# EAGLE design esp (EAGLE 9.0.1)
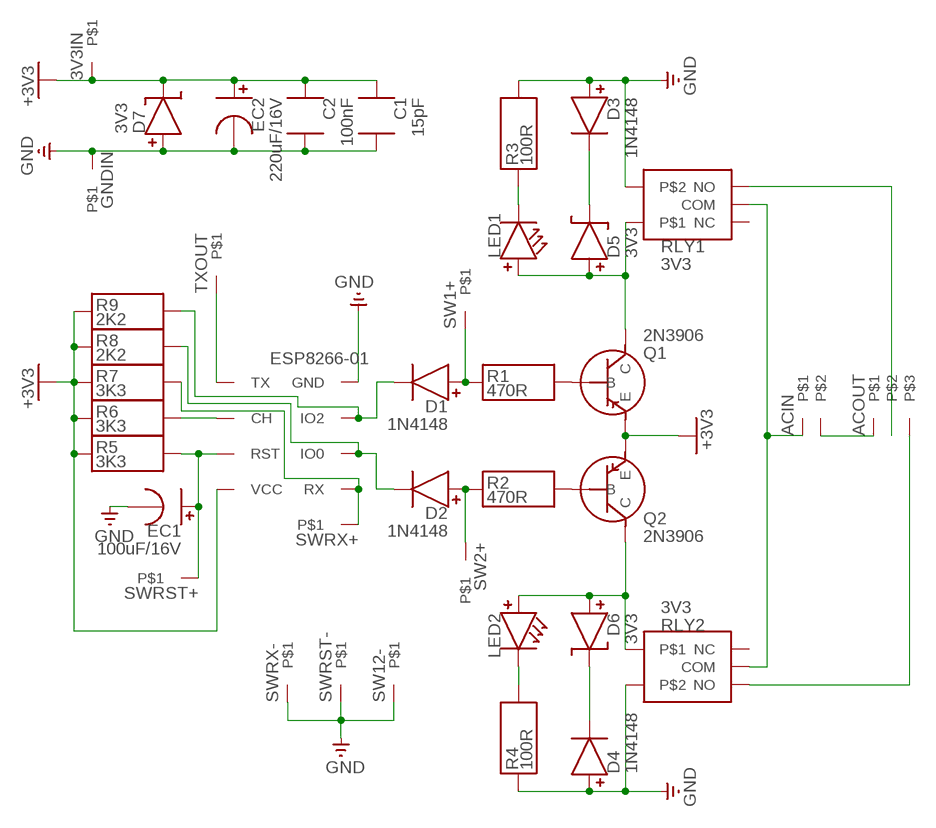
[diagram p0: schematic, sheet 1]

## Parts
3V3IN  CON1PINPLUG1  [PINPLUG1]
ACIN  CON2CON5.0S2T  [CON5.0S2T]
ACOUT  CON3CON5.0S3T  [CON5.0S3T]
C1  15pF  CAPACITORCERCAP3.2S  [CERCAP3.2S]
C2  100nF  CAPACITORCERCAP5.6S  [CERCAP5.6S]
D1  1N4148  RECTDIODERD5.0S1.8D  [RD5.0S1.8D]
D2  1N4148  RECTDIODERD5.0S1.8D  [RD5.0S1.8D]
D3  1N4148  RECTDIODERD5.0S1.8D  [RD5.0S1.8D]
D4  1N4148  RECTDIODERD5.0S1.8D  [RD5.0S1.8D]
D5  3V3  ZENDIODEZD6.0S2.0D  [ZD6.0S2.0D]
D6  3V3  ZENDIODEZD6.0S2.0D  [ZD6.0S2.0D]
D7  3V3  ZENDIODEZD6.0S2.0D  [ZD6.0S2.0D]
EC1  100uF/16V  ECAPACITORECAP3.2S5.0D  [ECAP3.2S5.0D]
EC2  220uF/16V  ECAPACITORECAP3.2S5.0D  [ECAP3.2S5.0D]
ESP8266-01  ESP8266E01ESP8266E01  [ESP8266E01]
GNDIN  CON1PINPLUG1  [PINPLUG1]
LED1  LEDLED3.2S5.0D  [LED3.2S5.0D]
LED2  LEDLED3.2S5.0D  [LED3.2S5.0D]
Q1  2N3906  BJTPNPTO92  [TO92]
Q2  2N3906  BJTPNPTO92  [TO92]
R1  470R  RESISTORHOR.25W  [HOR.25W]
R2  470R  RESISTORHOR.25W  [HOR.25W]
R3  100R  RESISTORHOR.25W  [HOR.25W]
R4  100R  RESISTORHOR.25W  [HOR.25W]
R5  3K3  RESISTORHOR.25W  [HOR.25W]
R6  3K3  RESISTORHOR.25W  [HOR.25W]
R7  3K3  RESISTORHOR.25W  [HOR.25W]
R8  2K2  RESISTORHOR.25W  [HOR.25W]
R9  2K2  RESISTORHOR.25W  [HOR.25W]
RLY1  3V3  RELAY5RLY15W19L  [RLY15W19L]
RLY2  3V3  RELAY5RLY15W19L  [RLY15W19L]
SW1+  CON1PINPLUG1  [PINPLUG1]
SW2+  CON1PINPLUG1  [PINPLUG1]
SW12-  CON1PINPLUG1  [PINPLUG1]
SWRST+  CON1PINPLUG1  [PINPLUG1]
SWRST-  CON1PINPLUG1  [PINPLUG1]
SWRX+  CON1PINPLUG1  [PINPLUG1]
SWRX-  CON1PINPLUG1  [PINPLUG1]
TXOUT  CON1PINPLUG1  [PINPLUG1]

## Nets
+3V3: 3V3IN.P$1 C1.P$1 C2.P$1 D7.P- EC2.P+ ESP8266-01.VCC Q1.3(E) Q2.3(E) R5.P$1 R6.P$1 R7.P$1 R8.P$1 R9.P$1
GND: C1.P$2 C2.P$2 D3.P+ D4.P+ D7.P+ EC1.P- EC2.P- ESP8266-01.GND GNDIN.P$1 R3.P$2 R4.P$1 RLY1.P$2 RLY2.P$2 SW12-.P$1 SWRST-.P$1 SWRX-.P$1
N$1: LED2.P- R4.P$2
N$2: ESP8266-01.CH R6.P$2
N$3: ESP8266-01.RX R7.P$2 SWRX+.P$1
N$4: Q1.2(B) R1.P$2
N$5: D1.P+ R1.P$1 SW1+.P$1
N$6: D2.P- ESP8266-01.IO0 R8.P$2
N$7: D6.P+ LED2.P+ Q2.1(C) RLY2.P$1
N$8: LED1.P- R3.P$1
N$9: D4.P- D6.P-
N$10: EC1.P+ ESP8266-01.RST R5.P$2 SWRST+.P$1
N$11 [ac]: ACOUT.P$3 RLY2.NO
N$12: D5.P+ LED1.P+ Q1.1(C) RLY1.P$1
N$13: ESP8266-01.TX TXOUT.P$1
N$14: D3.P- D5.P-
N$15 [ac]: ACOUT.P$2 RLY1.NO
N$16 [ac]: ACIN.P$2 ACOUT.P$1
N$17: Q2.2(B) R2.P$2
N$18: D2.P+ R2.P$1 SW2+.P$1
N$20 [ac]: ACIN.P$1 RLY1.COM RLY2.COM
N$23: D1.P- ESP8266-01.IO2 R9.P$2
Unconnected: RLY1.NC RLY2.NC

## Library data of the parts
3V3IN GNDIN SW1+ SW2+ SW12- SWRST+ SWRST- SWRX+ SWRX- TXOUT = simple-parts:CON1
ACIN = simple-parts:CON2
ACOUT = simple-parts:CON3
C1 C2 = simple-parts:CAPACITOR
D1-D4 = simple-parts:RECTDIODE
D5-D7 = simple-parts:ZENDIODE
EC1 EC2 = simple-parts:ECAPACITOR
ESP8266-01 = simple-parts:ESP8266E01
LED1 LED2 = simple-parts:LED
Q1 Q2 = simple-parts:BJTPNP
R1-R9 = simple-parts:RESISTOR
RLY1 RLY2 = simple-parts:RELAY5

## Net classes
0 default: width 0.45 mm, clearance 0.45 mm
1 ac: width 1 mm, clearance 1 mm

## Board
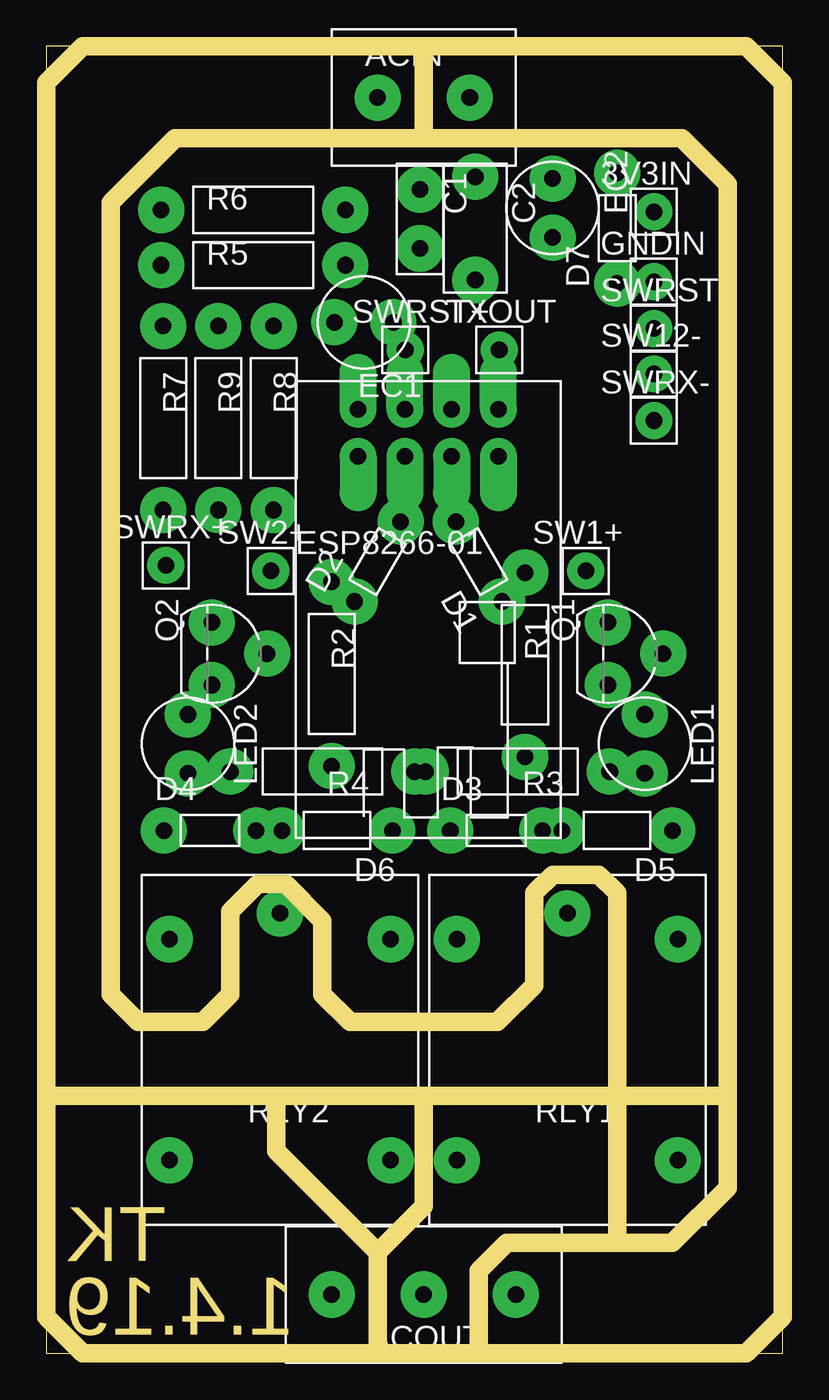
[diagram p1: board, top side]
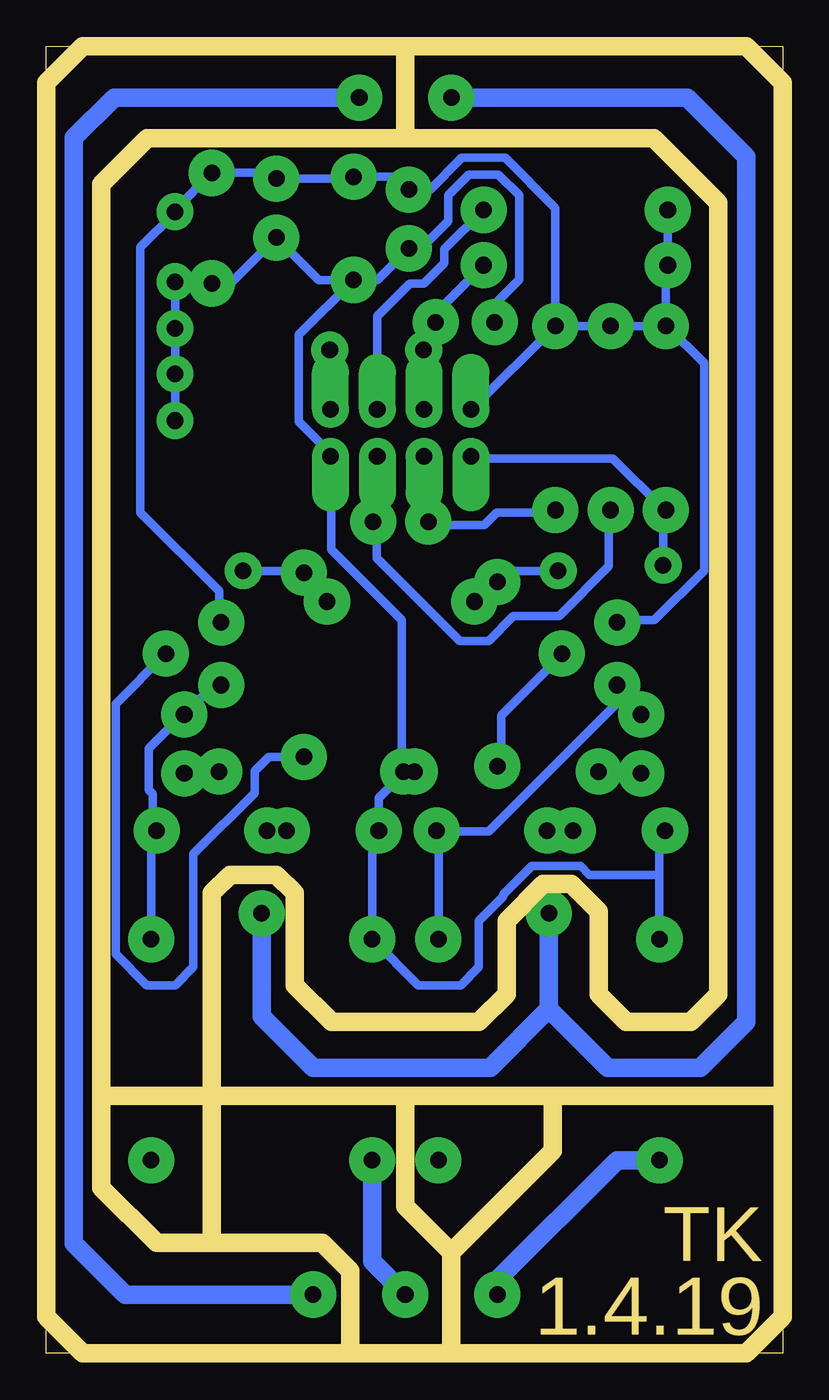
[diagram p2: board, bottom side, seen from below]

Size 40 x 71 mm. Coordinates in mm from the lower left corner, seen from the top.
Outline: 0,0 40,0 40,71 0,71 0,0
Copper layers (1*16): Top 0.035mm / dielectric 1.5mm / Bottom 0.035mm
Design rules "default": minimum track width 6mil, minimum drill 0.35mm, track to track 6mil, track to pad 6mil, pad to pad 6mil, via to via 6mil, smd to smd 6mil, copper to edge 40mil, drill to drill 6mil, minimum pad ring 10mil, minimum via ring 8mil, stop-mask expansion 4mil, vias tented up to drill 0mil, thermal gap 10mil
Milling: 51 lines

### Footprints (pad centres in the part's own frame; a part is rotated, then mirrored left to right if it is on the bottom)
PINPLUG1 = drill 0.9 pad 2: P$1 0,0
CON5.0S2T = drill 0.9 pad 2.5: P$1 -2.5,0; P$2 2.5,0
CON5.0S3T = drill 0.9 pad 2.5: P$1 -5,0; P$2 0,0; P$3 5,0
CERCAP3.2S = drill 0.9 pad 2.5: P$1 -1.6,0; P$2 1.6,0
CERCAP5.6S = drill 0.9 pad 2.5: P$1 -2.8,0; P$2 2.8,0
RD5.0S1.8D = drill 0.9 pad 2.5: P+ -2.5,0; P- 2.5,0
ZD6.0S2.0D = drill 0.9 pad 2.5: P+ -3,0; P- 3,0
ECAP3.2S5.0D = drill 0.9 pad 2.5: P+ -1.6,0; P- 1.6,0
ESP8266E01 = drill 0.9 pad 2 offset: CH -1.27,-1.27; GND -3.81,1.27; IO0 1.27,1.27; IO2 -1.27,1.27; RST 1.27,-1.27; RX 3.81,1.27; TX -3.81,-1.27; VCC 3.81,-1.27
LED3.2S5.0D = drill 0.9 pad 2.5: P+ -1.6,0; P- 1.6,0
TO92 = drill 0.9 pad 2.5: 1 1.7,0; 2 0,3; 3 -1.7,0
HOR.25W = drill 0.9 pad 2.5: P$1 -5,0; P$2 5,0
RLY15W19L = drill 0.9 pad 2.5: COM 0,-7.4; NC -6,6; NO 6,6; P$1 -6,-6; P$2 6,-6

### Placement (x,y rotation side)
3V3IN  33,62 0 top
ACIN  20.5,68.2 0 top
ACOUT  20.5,3.2 180 top
C1  20.3,61.61 270 top
C2  23.3,61.1 270 top
D1  23.5,43 120 top
D2  18,43 60 top
D3  24.44,28.4 0 top
D4  8.9,28.4 0 top
D5  31,28.4 180 top
D6  15.8,28.4 180 top
D7  31,61.11 90 top
EC1  17.25,56 180 top
EC2  27.5,62.2 270 top
ESP8266-01  20.75,50 180 top
GNDIN  33,58.2 0 top
LED1  32.5,33.1 270 top
LED2  7.7,33.1 270 top
Q1  30.5,38 270 top
Q2  9,38 270 top
R1  26,37.4 270 top
R2  15.5,36.9 270 top
R3  25.6,31.6 180 top
R4  15,31.6 180 top
R5  11.25,59.1 0 top
R6  11.25,62.1 0 top
R7  6.35,50.8 270 top
R8  12.35,50.8 270 top
R9  9.35,50.8 270 top
RLY1  28.3,16.5 180 top
RLY2  12.7,16.5 180 top
SW1+  29.3,42.5 0 top
SW2+  12.2,42.5 0 top
SW12-  33,53.2 0 top
SWRST+  19.5,54.5 0 top
SWRST-  33,55.66 0 top
SWRX+  6.5,42.8 0 top
SWRX-  33,50.66 0 top
TXOUT  24.6,54.5 0 top

### Tracks (layer width: path | path; a pad name or v marks a point on that pad's centre or on a via)
+3V3
  Bottom 0.45: R6.P$1 R5.P$1 6.35,59 R7.P$1 | R7.P$1 R9.P$1 R8.P$1 | R8.P$1 16.88,51.27 ESP8266-01.VCC | Q2.3 9,39.83 6.97,39.83 4.28,42.52 4.28,53.77 6.3,55.8 R7.P$1 | Q1.3 30.6,39.83 30.6,41.4 34.88,45.67 34.88,60.08 33.08,61.88 3V3IN.P$1 33,62.11 D7.P- 27.81,64.11 EC2.P+ 23.4,63.8 C2.P$1 20.99,63.9 C1.P$1 19.14,63.21 17.42,64.92 15.08,64.92 12.35,62.2 R8.P$1
GND
  Bottom 0.45: RLY2.P$2 6.7,26 | 6.7,26 6.7,28.1 D4.P+ | 6.7,26 10.5,26 10.97,26.48 13.62,26.48 15.18,24.93 15.18,24.82 16.5,23.5 16.5,21 17.5,20 19.8,20 RLY1.P$2 22.3,28.04 D3.P+ 21.94,30.16 20.5,31.6 | C2.P$2 25.2,58.3 EC2.P- 29.99,58.11 D7.P+ 31.09,58.2 GNDIN.P$1 SWRST-.P$1 SW12-.P$1 SWRX-.P$1 32.85,50.62 | C2.P$2 22.01,58.3 C1.P$2 19.66,60.01 18.18,61.49 18.18,62.9 17.05,64.03 15.45,64.03 14.32,62.9 14.32,58.3 15.65,56.98 EC1.P- | 20.5,31.6 R3.P$2 20.7,31.73 20.7,39.83 24.52,43.65 24.52,48.6 ESP8266-01.GND | 20.5,31.6 R4.P$1 | 24.75,48.83 ESP8266-01.GND | ESP8266-01.GND 24.56,48.9 26.27,50.62 26.27,55.33 C2.P$2
N$1
  Bottom 0.45: LED2.P- 7.8,31.6 R4.P$2
N$2
  Bottom 0.45: ESP8266-01.CH 22.02,56.33 20.27,58.09 19.5,58.09 18.38,59.21 18.38,59.98 R6.P$2
N$3
  Bottom 0.45: SWRX+.P$1 6.5,45.65 R7.P$2 6.53,45.9 9.22,48.6 16.88,48.6 ESP8266-01.RX
N$4
  Bottom 0.45: R1.P$2 27.9,32.4 28.68,31.62 28.68,30.45 32,27.12 32,21 33,20 34.52,20 36.23,21.7 36.23,35.27 Q1.2
N$5
  Bottom 0.45: SW1+.P$1 26.1,42.5 R1.P$1 24.75,41.15 D1.P+
N$6
  Bottom 0.45: ESP8266-01.IO0 19.48,45.4 D2.P- 19.12,45 16.2,45 15.53,45.67 12.38,45.67 R8.P$2
N$7
  Bottom 0.45: LED2.P+ 9,36 Q2.1 8.78,35.55 15.97,28.35 18.45,28.35 D6.P+ 18.68,28.35 18.68,22.5 RLY2.P$1
N$8
  Bottom 0.45: LED1.P- 32.4,31.6 R3.P$1
N$9
  Bottom 0.45: D4.P- D6.P-
N$10
  Bottom 0.45: ESP8266-01.RST 19.48,54.48 SWRST+.P$1 19.5,55.35 EC1.P+ 18.85,56.5 R5.P$2
N$11
  Bottom 1: RLY2.NO 9,10.5 15.5,4 ACOUT.P$3
N$12
  Bottom 0.45: Q1.1 30.9,36.3 LED1.P+ 32.62,34.65 34.42,32.85 34.42,30.6 34.2,30.38 34.2,28.57 D5.P+ 34.3,28.1 RLY1.P$1
N$13
  Bottom 0.45: ESP8266-01.TX 24.56,54.46 TXOUT.P$1
N$14
  Bottom 0.45: D5.P- D3.P-
N$15
  Bottom 1: RLY1.NO 22.3,5 ACOUT.P$2
N$16
  Bottom 1: ACOUT.P$1 35.7,3.2 38.48,5.98 38.48,66.02 36.3,68.2 ACIN.P$2
N$17
  Bottom 0.45: R2.P$2 15.3,31.95 15.3,34.65 12.15,37.8 Q2.2
N$18
  Bottom 0.45: D2.P+ 15.69,41.9 R2.P$1 14.9,42.5 SW2+.P$1
N$20
  Bottom 1: ACIN.P$1 5.2,68.2 2,65 2,18 4.5,15.5 9.5,15.5 12.7,18.7 | 12.7,18.7 RLY2.COM | 12.7,18.7 15.9,15.5 25.5,15.5 28.3,18.3 RLY1.COM
N$23
  Bottom 0.45: ESP8266-01.IO2 22.02,45.4 D1.P- 22.05,45 22.05,43.2 17.55,38.7 15.97,38.7 14.62,40.05 12.15,40.05 9.45,42.75 9.45,45.67 R9.P$2

### Text on the board
Milling: TK | 1.4.19